# EAGLE schematic control_board (EAGLE 7.0.0)
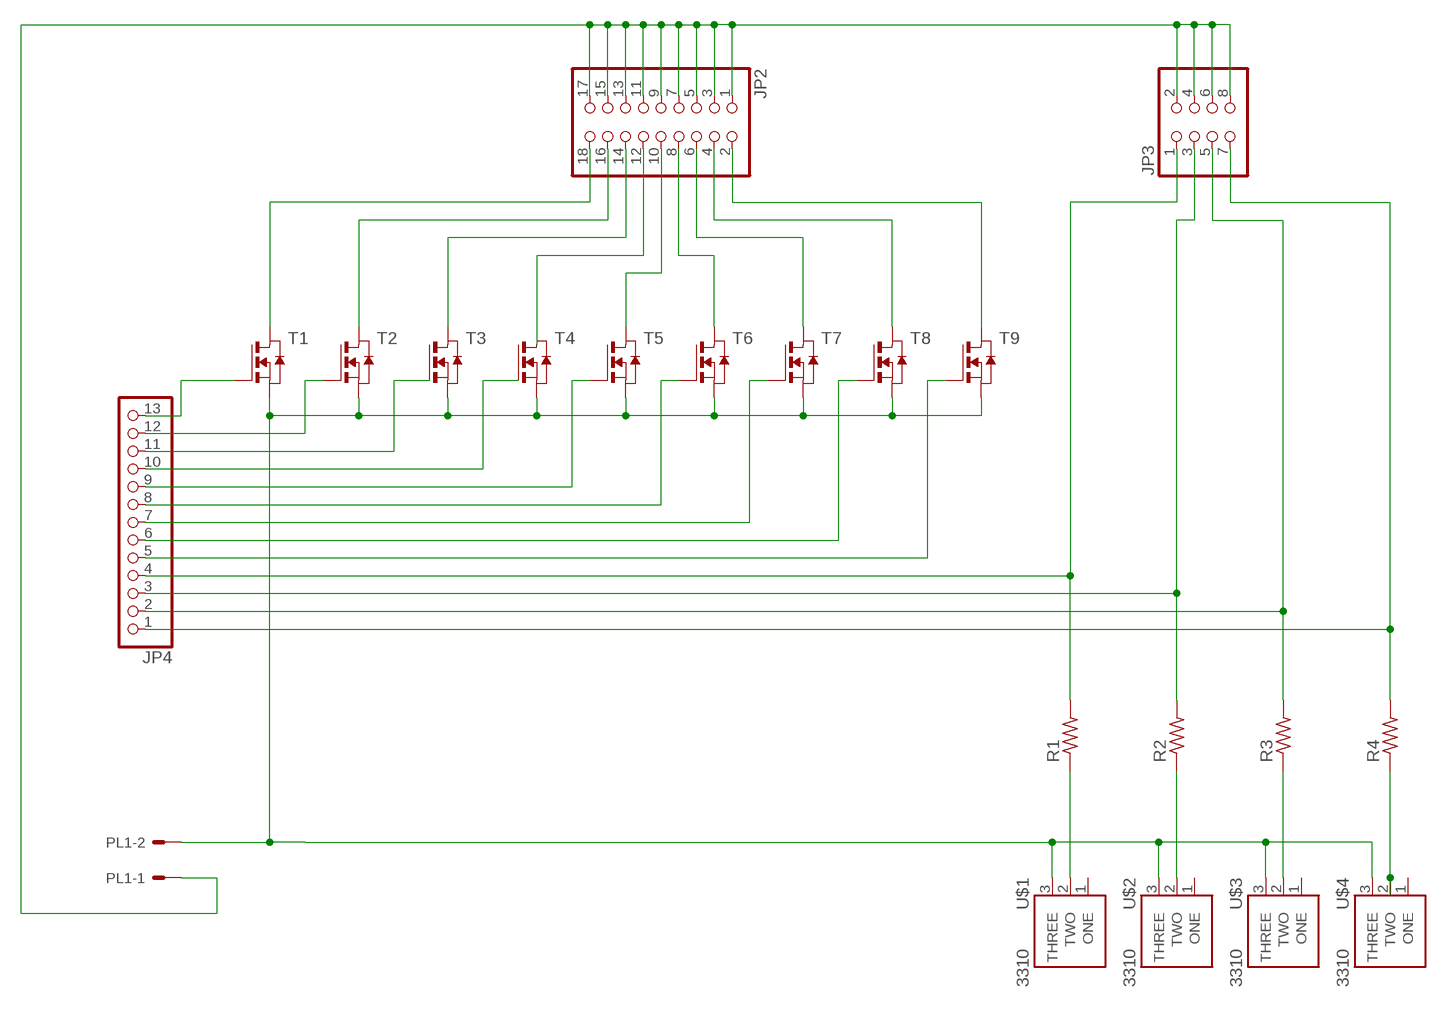
[diagram p0: schematic, sheet 1]

## Parts
JP2  PINHD-2X9-BIG  [2X09-BIG]
JP3  PINHD-2X4  [2X04]
JP4  PINHD-1X13  [1X13]
PL1  555X-2H  [5569-2]
R1  R-US_R0805  [R0805]
R2  R-US_R0805  [R0805]
R3  R-US_R0805  [R0805]
R4  R-US_R0805  [R0805]
T1  NMOSSOT223  [SOT223]
T2  NMOSSOT223  [SOT223]
T3  NMOSSOT223  [SOT223]
T4  NMOSSOT223  [SOT223]
T5  NMOSSOT223  [SOT223]
T6  NMOSSOT223  [SOT223]
T7  NMOSSOT223  [SOT223]
T8  NMOSSOT223  [SOT223]
T9  NMOSSOT223  [SOT223]
U$1  3310-001  [3310-001-TH]
U$2  3310-001  [3310-001-TH]
U$3  3310-001  [3310-001-TH]
U$4  3310-001  [3310-001-TH]

## Nets
N$1: JP4.13 T1.1(G)
N$2: JP4.12 T2.1(G)
N$3: JP4.11
N$4: JP4.10
N$5: JP4.9 T5.1(G)
N$6: PL1.2 T1.3(S) T2.3(S) T3.3(S) T4.3(S) T5.3(S) T6.3(S) T7.3(S) T8.3(S) T9.3(S) U$1.3(THREE) U$2.3(THREE) U$3.3(THREE) U$4.3(THREE)
N$7: JP3.3 JP4.3 R2.2
N$8: R3.1 U$3.2(TWO)
N$9: JP3.5 JP4.2 R3.2
N$10: R4.1 U$4.2(TWO)
N$11: R1.1 U$1.2(TWO)
N$12: JP3.1 JP4.4 R1.2
N$13: R2.1 U$2.2(TWO)
N$14: JP3.7 JP4.1 R4.2
N$15: JP2.18 T1.2(D) T1.4(D)
N$16: JP2.16 T2.2(D) T2.4(D)
N$17: JP2.2 T9.2(D) T9.4(D)
N$18: JP2.4 T8.2(D) T8.4(D)
N$19: JP2.6 T7.2(D) T7.4(D)
N$20: JP2.8 T6.2(D) T6.4(D)
N$21: JP2.14 T3.2(D) T3.4(D)
N$22: JP2.12
N$23: JP2.10 T5.2(D) T5.4(D)
N$24: JP2.1 JP2.3 JP2.5 JP2.7 JP2.9 JP2.11 JP2.13 JP2.15 JP2.17 JP3.2 JP3.4 JP3.6 JP3.8 PL1.1
N$25: JP4.8 T6.1(G)
N$26: JP4.7 T7.1(G)
N$27: JP4.6 T8.1(G)
N$28: JP4.5 T9.1(G)
Unconnected: T3.1(G) T4.1(G) T4.2(D) T4.4(D) U$1.1(ONE) U$2.1(ONE) U$3.1(ONE) U$4.1(ONE)

## Library data of the parts
JP2 = adafruit:PINHD-2X9: PIN HEADER With larger annulars
JP3 = adafruit:PINHD-2X4: PIN HEADER
JP4 = adafruit:PINHD-1X13: PIN HEADER
PL1 = con-molex-2:555X-2: Mini FIT connector 2 way
R1-R4 = adafruit:R-US_: RESISTOR, American symbol
T1-T9 = zetex:NMOSSOT223: MOS FET; OC_FARNELL: unknown; OC_NEWARK: unknown
U$1-U$4 = 3310-001:3310-001